# EAGLE design above water attachment (EAGLE 7.6.0)
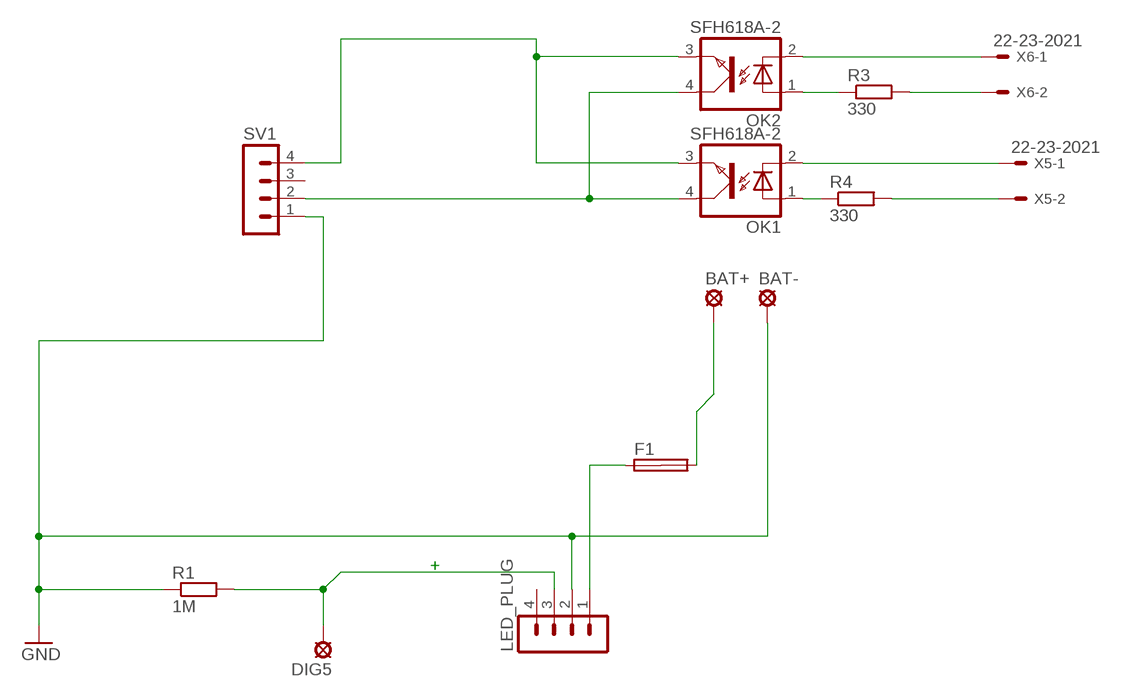
[diagram p0: schematic, sheet 1]

## Parts
BAT+  bat+  SE14  [SE14]
BAT-  Bat-  SE14  [SE14]
DIG5  Led-  SE14  [SE14]
F1  SHK20Q  [SHK20Q]
LED_PLUG  MA04-1  [MA04-1]
OK1  SFH618A-2  [DIP4]
OK2  SFH618A-2  [DIP4]
R1  1M  R-EU_R2512  [R2512]
R3  330  R-EU_R1206  [R1206]
R4  330  R-EU_R1206  [R1206]
SV1  MA04-1  [MA04-1]
X5  22-23-2021  [22-23-2021]
X6  22-23-2021  [22-23-2021]

## Nets
GND: BAT-.MP LED_PLUG.2 R1.1 SV1.1
N$1: OK1.4(COL) OK2.4(COL) SV1.2
N$2: BAT+.MP F1.2A
N$3: DIG5.MP LED_PLUG.3 R1.2
N$4: OK1.3(EMIT) OK2.3(EMIT) SV1.4
N$6: R4.2 X5.2
N$7: R3.2 X6.2
N$8: OK2.2(C) X6.1
N$9: OK1.2(C) X5.1
N$10: OK1.1(A) R4.1
N$11: OK2.1(A) R3.1
N$14: F1.1A LED_PLUG.1
Unconnected: F1.1B F1.2B LED_PLUG.4 SV1.3

## Notes on the sheet
- +

## Library data of the parts
BAT+ BAT- DIG5 = solpad:SE14: SOLDER PAD E1553, drill 1,4mm, distributor Buerklin, 07F820
F1 = fuse:SHK20Q: FUSE HOLDER 5 x 20 mm, SH contact, E1207 Buerklin 64G6061; OC_FARNELL: unknown; OC_NEWARK: unknown
LED_PLUG SV1 = con-lstb:MA04-1: PIN HEADER; OC_FARNELL: unknown; OC_NEWARK: unknown
OK1 OK2 = optocoupler:SFH618?*: Optocoupler, Phototransistor Output, Low Input Current Source: Data sheet <http://www.vishay.com/docs/83673/sfh618.pdf>; MF: VISHAY/TELEFUNKEN; MPN: SFH618A-2; OC_FARNELL: 6424855; OC_NEWARK: 21H7744
R1 R3 R4 = resistor:R-EU_: RESISTOR, European symbol
X5 X6 = con-molex:22-23-2021: .100" (2.54mm) Center Header - 2 Pin; MF: MOLEX; MPN: 22-23-2021; OC_FARNELL: 1462926; OC_NEWARK: 25C3832

## Net classes
0 default: width 0.305 mm, drill 0.508 mm, clearance 0.254 mm

## Board
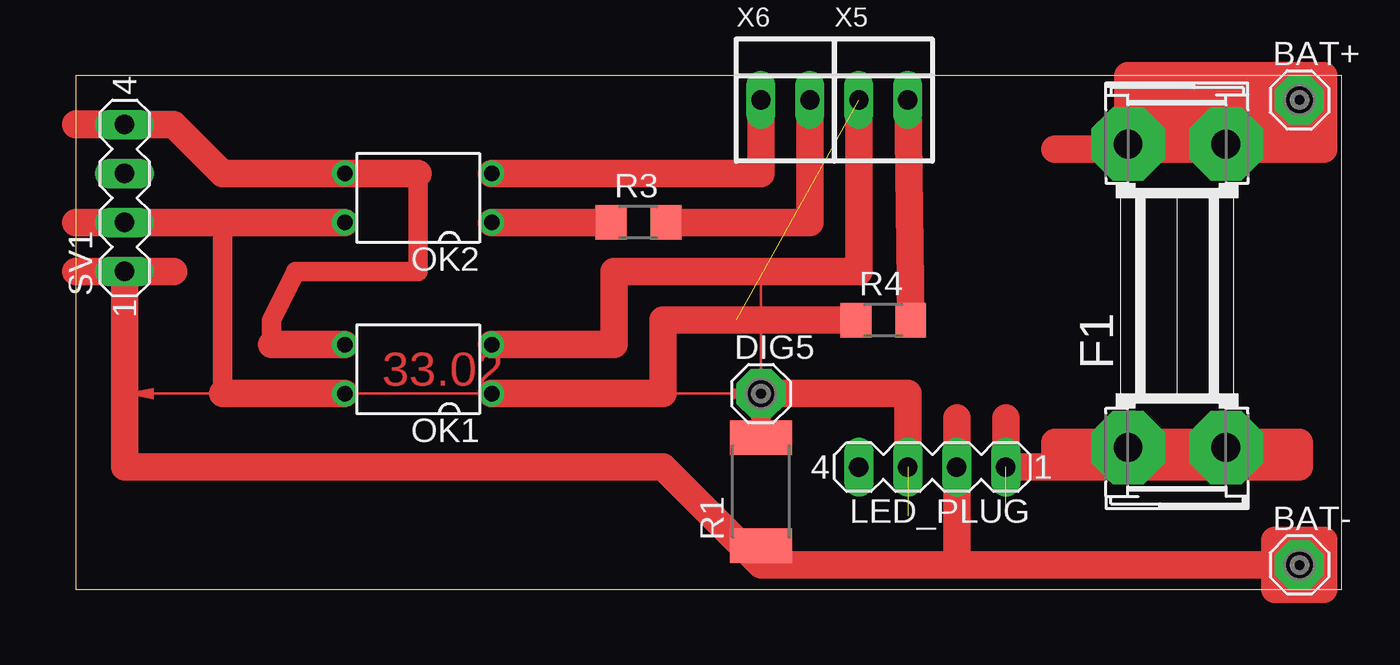
[diagram p1: board, top side]
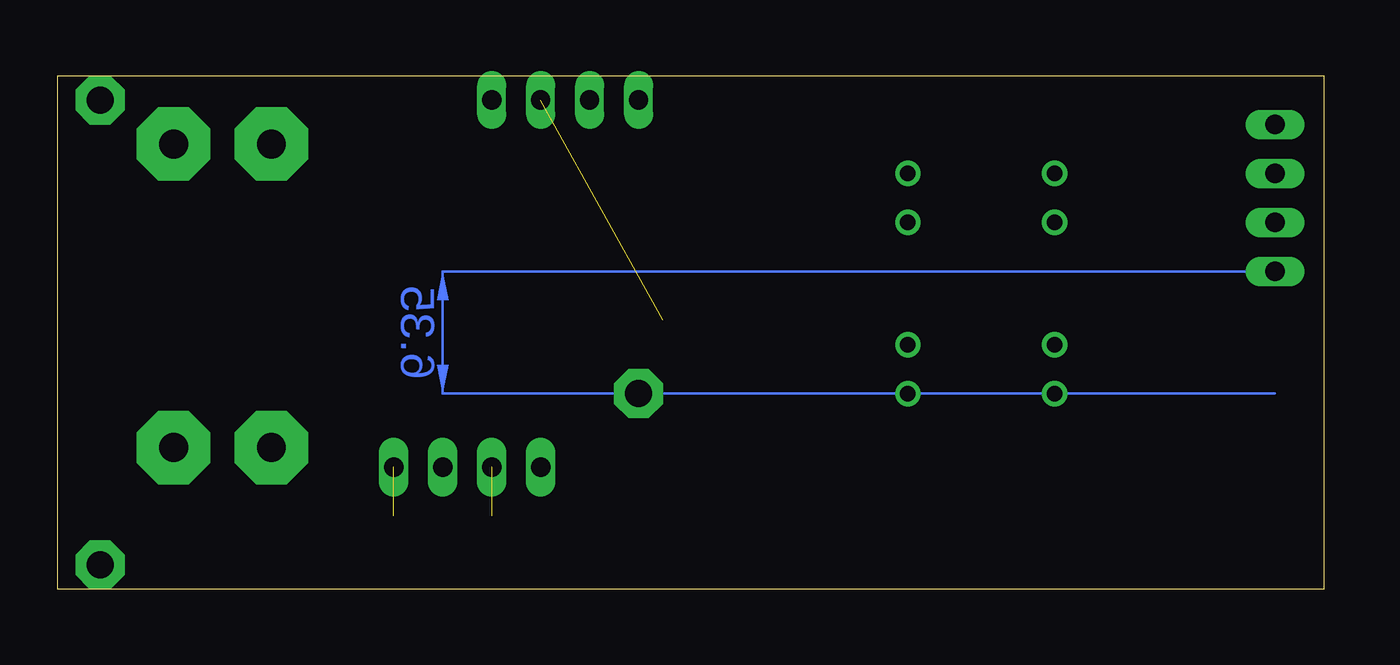
[diagram p2: board, bottom side, seen from below]

Size 65.71 x 26.66 mm. Coordinates in mm from the lower left corner, seen from the top.
Outline: 0,0 65.71,0 65.71,26.66 0,26.66 0,0
Copper layers (1*16): Top 0.035mm / dielectric 1.5mm / Bottom 0.035mm
Design rules "default *": minimum track width 10mil, minimum drill 24mil, track to track 1mm, track to pad 1mm, pad to pad 1mm, via to via 1mm, smd to smd 8mil, copper to edge 1mil, drill to drill 1mil, minimum pad ring 10mil, minimum via ring 8mil, stop-mask expansion 4mil, vias tented up to drill 0mil, thermal gap 10mil

### Footprints (pad centres in the part's own frame; a part is rotated, then mirrored left to right if it is on the bottom)
SE14 = drill 1.397 pad 2.54 octagon: MP 0,0
SHK20Q = drill 1.5 pad 3.81 octagon: 1A -7.874,2.54; 1B -7.874,-2.54; 2A 7.874,2.54; 2B 7.874,-2.54
MA04-1 = drill 1.016 long: 1 -3.81,0; 2 -1.27,0; 3 1.27,0; 4 3.81,0
DIP4 = drill 0.8: 1 -1.27,-3.81; 2 1.27,-3.81; 3 1.27,3.81; 4 -1.27,3.81
R2512 = smd 1.8 x 3.2: 1 -2.8,0; 2 2.8,0
R1206 = smd 1.6 x 1.803: 1 -1.422,0; 2 1.422,0
22-23-2021 = drill 1 long: 1 -1.27,0; 2 1.27,0

### Placement (x,y rotation side)
BAT+  63.5,25.4 0 top
BAT-  63.5,1.27 0 top
DIG5  35.56,10.16 0 top
F1  57.15,15.24 90 top
LED_PLUG  44.45,6.35 180 top
OK1  17.78,11.43 90 top
OK2  17.78,20.32 90 top
R1  35.56,5.08 90 top
R3  29.21,19.05 0 top
R4  41.91,13.97 0 top
SV1  2.54,20.32 90 top
X5  41.91,25.4 0 top
X6  36.83,25.4 0 top

### Tracks (layer width: path | path; a pad name or v marks a point on that pad's centre or on a via)
GND
  Top 0.305: 2.9,16.31 SV1.1
  Top 1.422: SV1.1 0,16.51 | 45.72,8.89 LED_PLUG.2 45.72,1.27 | R1.1 35.56,1.27 | 35.56,1.27 45.72,1.27 | 45.72,1.27 62.23,1.27 | 62.23,1.27 62.23,2.54 64.77,2.54 64.77,0 62.23,0 62.23,1.27 | 62.23,1.27 BAT-.MP | 5.08,16.51 SV1.1 | SV1.1 2.54,6.35 30.48,6.35 35.56,1.27
N$1
  Top 1.016: 7.62,10.16 7.62,19.05
  Top 1.422: OK1.4 7.62,10.16 | OK2.4 7.62,19.05 SV1.2 0,19.05
N$2
  Top 1.422: 50.8,22.86 54.61,22.86 | F1.2A 54.61,22.86 | 54.61,22.86 64.77,22.86 64.77,24.13 | 64.77,24.13 54.61,24.13 | 54.61,24.13 54.61,25.4 BAT+.MP 64.77,25.4 | 64.77,25.4 64.77,24.13 | 64.77,25.4 64.77,26.67 54.61,26.67 F1.2A | F1.2A 54.61,24.13
N$3  (1 unrouted)
  Top 1.016: DIG5.MP R1.2
  Top 1.422: LED_PLUG.3 43.18,10.16 DIG5.MP
N$4
  Top 0.305: 2.9,24.14 SV1.4
  Top 0.813: SV1.4
  Top 1.016: 17.78,21.59 17.78,16.51 11.43,16.51 10.16,13.97 10.16,12.7
  Top 1.422: OK1.3 10.16,12.7 | 17.78,21.59 OK2.3 7.62,21.59 5.08,24.13 0,24.13 0.01,24.14 SV1.4
N$6
  Top 1.422: X5.2 R4.2
N$7
  Top 1.422: X6.2 38.1,19.05 R3.2
N$8
  Top 1.422: OK2.2 35.56,21.59 X6.1
N$9  (1 unrouted)
  Top 1.422: OK1.2 27.94,12.7 27.94,16.51 40.64,16.51 X5.1
N$10
  Top 1.422: OK1.1 30.48,10.16 30.48,13.97 R4.1
N$11
  Top 1.422: OK2.1 R3.1
N$14  (1 unrouted)
  Top 1.422: 48.26,8.89 LED_PLUG.1 50.8,6.35 | 54.36,6.35 54.36,7.62 | 54.36,7.62 63.5,7.62 | 54.36,7.62 50.8,7.62 50.8,6.35 | 54.36,6.35 50.8,6.35 | 54.36,6.35 63.5,6.35 63.5,7.62 | 63.5,7.62 arc-90 63.25,7.37 F1.1A
(copper drawn outside any net)
  shapes: Bottom area x1, Top area x1